# Altium schematic sheet MCU.SchDoc: Hat MCU Group 24
size A3; DrawnBy: Jonny, Jamie, John, David; Address1: ECE Department; Address2: University of Canterbury; Address3: Christchurch 8041; Address4: New Zealand; Revision: 2; SheetNumber: 1; SheetTotal: 2; ImagePath: \\maxwell\elecapp\AltiumDesigner\Templates\uc-logo.png
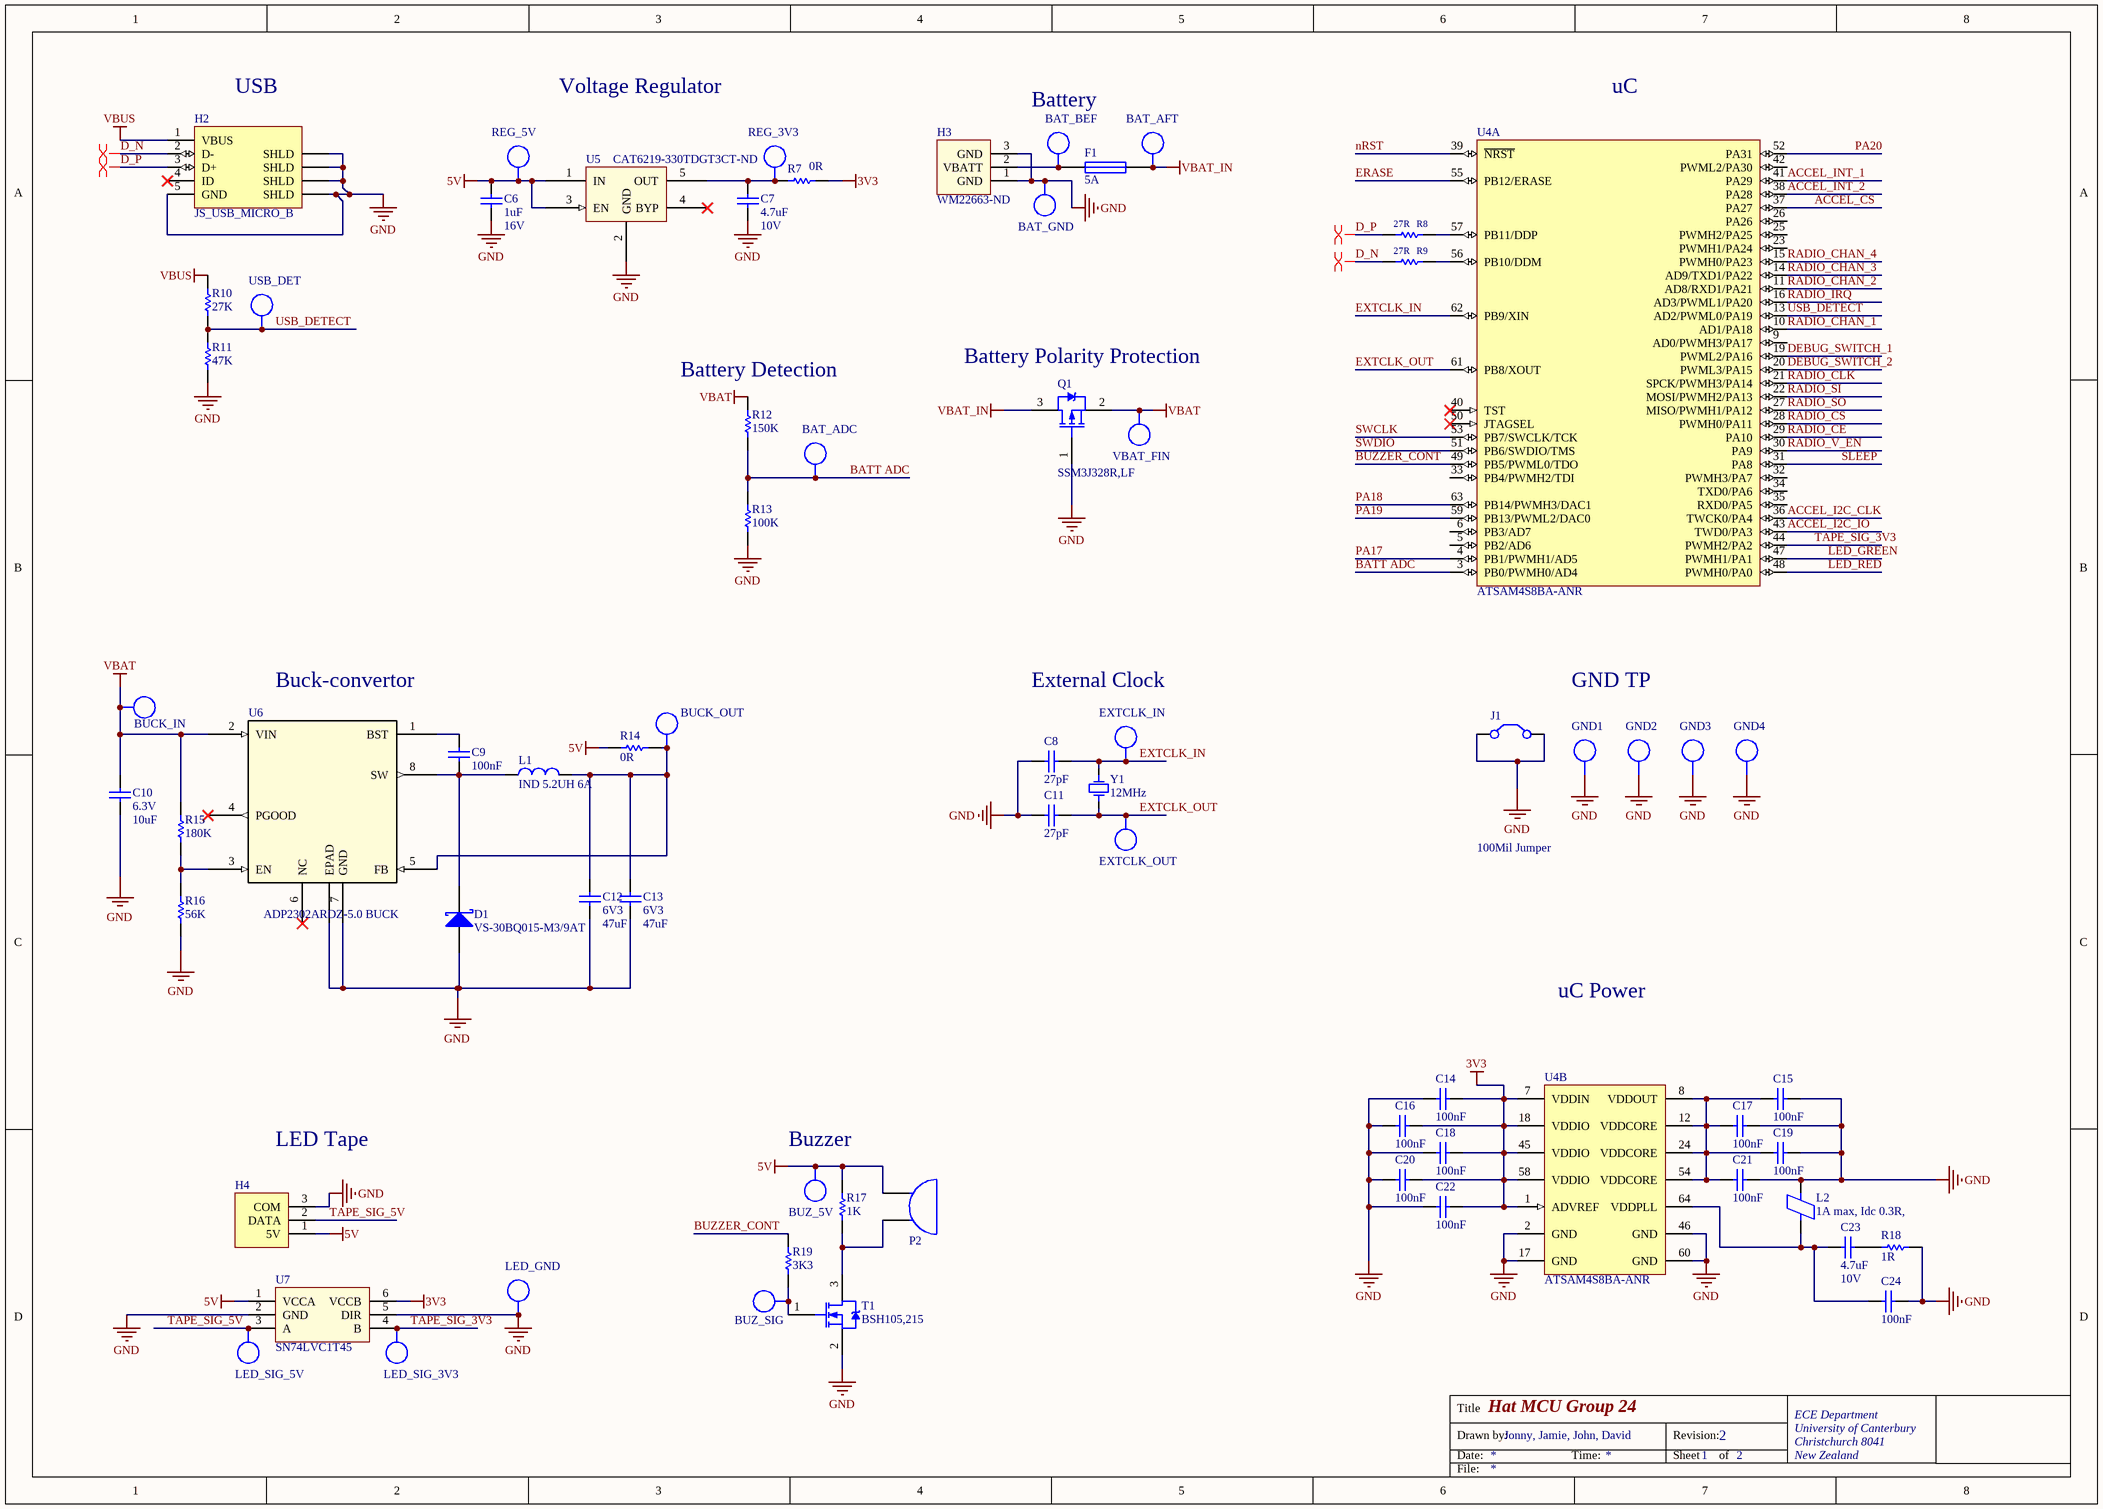
[diagram p0: MCU.SchDoc]

## Parts
BAT_ADC  TP  [TP_1206]  (value not drawn)  (no BOM)
BAT_AFT  TP  [TP_1206]  (value not drawn)  (no BOM)
BAT_BEF  TP  [TP_1206]  (value not drawn)  (no BOM)
BAT_GND  TP  [TP_1206]  (value not drawn)  (no BOM)
BUCK_IN  TP  [TP_1206]  (value not drawn)  (no BOM)
BUCK_OUT  TP  [TP_1206]  (value not drawn)  (no BOM)
BUZ_5V  TP  [TP_1206]  (value not drawn)  (no BOM)
BUZ_SIG  TP  [TP_1206]  (value not drawn)  (no BOM)
C6  Max Voltage: 16V  [CAPC1608L]  (hidden comment: 1uF)
C7  Max Voltage: 10V  [CAPC1608N]  (hidden comment: 4.7uF)
C8  27pF  [CAPC1608L]
C9  100nF  [CAPC1608L]
C10  Voltage - Rated: 6.3V  [CAPC1608L]  (hidden comment: 10uF)
C11  27pF  [CAPC1608L]
C12  Voltage Rating: 6V3  Capacitance: 47uF  [CAPC2012N]  (hidden comment: CC_47uF_0805_6V3)
C13  Voltage Rating: 6V3  Capacitance: 47uF  [CAPC2012N]  (hidden comment: CC_47uF_0805_6V3)
C14  100nF  [CAPC1608L]
C15  100nF  [CAPC1608L]
C16  100nF  [CAPC1608L]
C17  100nF  [CAPC1608L]
C18  100nF  [CAPC1608L]
C19  100nF  [CAPC1608L]
C20  100nF  [CAPC1608L]
C21  100nF  [CAPC1608L]
C22  100nF  [CAPC1608L]
C23  Max Voltage: 10V  [CAPC1608N]  (hidden comment: 4.7uF)
C24  100nF  [CAPC1608L]
D1  VS-30BQ015-M3/9AT  [SMC]
EXTCLK_IN  TP  [TP_1206]  (value not drawn)  (no BOM)
EXTCLK_OUT  TP  [TP_1206]  (value not drawn)  (no BOM)
F1  5A  [RESC3216N]
GND1  TP  [TP_1206]  (value not drawn)  (no BOM)
GND2  TP  [TP_1206]  (value not drawn)  (no BOM)
GND3  TP  [TP_1206]  (value not drawn)  (no BOM)
GND4  TP  [TP_1206]  (value not drawn)  (no BOM)
H2  JS_USB_MICRO_B  [FCI_USB_10118194-0001LF]
H3  Supplier Part Number 1: WM22663-ND  [BATT_HEADER_3POS]  (hidden comment: Battery_HEADER_3pin)
H4  3 Pin Molex KK Hdr  [MOLEX_KK_3_HDR]  (value not drawn)
J1  100Mil Jumper  [JMP2.54]
L1  IND 5.2UH 6A  [INDUCTOR5u2]
L2  1A max, Idc 0.3R,  [INDC3216L]
LED_GND  TP  [TP_1206]  (value not drawn)  (no BOM)
LED_SIG_3V3  TP  [TP_1206]  (value not drawn)  (no BOM)
LED_SIG_5V  TP  [TP_1206]  (value not drawn)  (no BOM)
P2  Piezo Buzzer  [BUZZER]  (value not drawn)
Q1  SSM3J328R,LF  [SOT23_L]
R7  0R  [RESC1608L]
R8  27R  [RESC1608L]
R9  27R  [RESC1608L]
R10  27K  [RESC1608L]
R11  47K  [RESC1608N]
R12  150K  [RESC1608L]
R13  100K  [RESC1608L]
R14  0R  [RESC1608L]
R15  value 180K  [RESC1608L]
R16  56K  [RESC1608L]
R17  1K  [RESC1608L]
R18  1R  [RESC3216L]
R19  3K3  [RESC1608L]
REG_3V3  TP  [TP_1206]  (value not drawn)  (no BOM)
REG_5V  TP  [TP_1206]  (value not drawn)  (no BOM)
T1  BSH105,215  [SOT23_L]
U4  ATSAM4S8BA-ANR  [LQFP64_L]  (parts A,B of 2)
U5  Supplier Part Number: CAT6219-330TDGT3CT-ND  [SOT95P280X145-5N]  (hidden comment: CAT6219-330TDGT3)
U6  ADP2302ARDZ-5.0 BUCK  [RD_8_1]
U7  SN74LVC1T45  [SOT23-6_N]
USB_DET  TP  [TP_1206]  (value not drawn)  (no BOM)
VBAT_FIN  TP  [TP_1206]  (value not drawn)  (no BOM)
Y1  12MHz  [6.0X3.5-4]

## Nets
3V3: C14.2 C16.2 C18.2 C20.2 C22.2 R7.2 U4.1(ADVREF) U4.7(VDDIN) U4.18(VDDIO) U4.45(VDDIO) U4.58(VDDIO) U7.6(VCCB)
5V: BUZ_5V.1 C6.1 H4.1(5V) P2.1 R14.2 R17.2 REG_5V.1 U5.1(IN) U5.3(EN) U7.1(VCCA)
GND: BAT_GND.1 C6.2 C7.1 C8.1 C10.1 C11.1 C12.1 C13.1 C14.1 C15.2 C16.1 C17.2 C18.1 C19.2 C20.1 C21.2 C22.1 C24.1 D1.1(A) GND1.1 GND2.1 GND3.1 GND4.1 H2.5(GND) H2.6(SHLD) H3.1(GND) H3.3(GND) H4.3(COM) J1.1(C1) J1.2(C2) L2.2 LED_GND.1 Q1.1 R11.1 R13.1 R16.1 R18.1 T1.2 U4.2(GND) U4.17(GND) U4.46(GND) U4.60(GND) U5.2(GND) U6.7(GND) U6.EPAD U7.2(GND) U7.5(DIR)
VBAT: BUCK_IN.1 C10.2 Q1.2 R12.2 R15.2 U6.2(VIN) VBAT_FIN.1
VBAT_IN: BAT_AFT.1 F1.2 Q1.3
VBUS: H2.1(VBUS) R10.1
ACCEL_CS: U4.37(PA27)
ACCEL_I2C_CLK: U4.36(TWCK0/PA4)
ACCEL_I2C_IO: U4.43(TWD0/PA3)
ACCEL_INT_1: U4.41(PA29)
ACCEL_INT_2: U4.38(PA28)
BATT ADC: BAT_ADC.1 R12.1 R13.2 U4.3(PB0/PWMH0/AD4)
BUZZER_CONT: R19.1 U4.49(PB5/PWML0/TDO)
D_N: H2.2(D-) R9.1
D_P: H2.3(D+) R8.1
DEBUG_SWITCH_1: U4.19(PWML2/PA16)
DEBUG_SWITCH_2: U4.20(PWML3/PA15)
ERASE: U4.55(PB12/ERASE)
EXTCLK_IN: C8.2 EXTCLK_IN.1 U4.62(PB9/XIN) Y1.3(OSC2)
EXTCLK_OUT: C11.2 EXTCLK_OUT.1 U4.61(PB8/XOUT) Y1.1(OSC1)
LED_GREEN: U4.47(PWMH1/PA1)
LED_RED: U4.48(PWMH0/PA0)
nRST: U4.39(~{NRST})
PA17: U4.4(PB1/PWMH1/AD5)
PA18: U4.63(PB14/PWMH3/DAC1)
PA19: U4.59(PB13/PWML2/DAC0)
PA20: U4.52(PA31)
RADIO_CE: U4.29(PA10)
RADIO_CHAN_1: U4.10(AD1/PA18)
RADIO_CHAN_2: U4.11(AD8/RXD1/PA21)
RADIO_CHAN_3: U4.14(AD9/TXD1/PA22)
RADIO_CHAN_4: U4.15(PWMH0/PA23)
RADIO_CLK: U4.21(SPCK/PWMH3/PA14)
RADIO_CS: U4.28(PWMH0/PA11)
RADIO_IRQ: U4.16(AD3/PWML1/PA20)
RADIO_SI: U4.22(MOSI/PWMH2/PA13)
RADIO_SO: U4.27(MISO/PWMH1/PA12)
RADIO_V_EN: U4.30(PA9)
SLEEP: U4.31(PA8)
SWCLK: U4.53(PB7/SWCLK/TCK)
SWDIO: U4.51(PB6/SWDIO/TMS)
TAPE_SIG_3V3: LED_SIG_3V3.1 U4.44(PWMH2/PA2) U7.4(B)
TAPE_SIG_5V: H4.2(DATA) LED_SIG_5V.1 U7.3(A)
USB_DETECT: R10.2 R11.2 U4.13(AD2/PWML0/PA19) USB_DET.1
NetBAT_BEF_1: BAT_BEF.1 F1.1 H3.2(VBATT)
NetBUCK_OUT_1: BUCK_OUT.1 C12.2 C13.2 L1.2 R14.1 U6.5(FB)
NetBUZ_SIG_1: BUZ_SIG.1 R19.2 T1.1
NetC7_2: C7.2 R7.1 REG_3V3.1 U5.5(OUT)
NetC9_1: C9.1 D1.2(K) L1.1 U6.8(SW)
NetC9_2: C9.2 U6.1(BST)
NetC15_1: C15.1 C17.1 C19.1 C21.1 U4.8(VDDOUT) U4.12(VDDCORE) U4.24(VDDCORE) U4.54(VDDCORE)
NetC23_1: C23.1 R18.2
NetC23_2: C23.2 C24.2 L2.1 U4.64(VDDPLL)
NetP2_2: P2.2 R17.1 T1.3
NetR8_2: R8.2 U4.57(PB11/DDP)
NetR9_2: R9.2 U4.56(PB10/DDM)
NetR15_1: R15.1 R16.2 U6.3(EN)

Not connected (* = marked no-connect by the designer): H2 4(ID)*; U4 5(PB2/AD6) 6(PB3/AD7) 9(AD0/PWMH3/PA17) 23(PWMH1/PA24) 25(PWMH2/PA25) 26(PA26) 32(PWMH3/PA7) 33(PB4/PWMH2/TDI) 34(TXD0/PA6) 35(RXD0/PA5) 40(TST)* 42(PWML2/PA30) 50(JTAGSEL)*; U5 4(BYP)*; U6 4(PGOOD)* 6(NC)*

## Layout directives
differential pair: D_N, D_P

## Notes on the sheet
- (near H2) USB
- Voltage Regulator
- Battery
- uC
- (near R12) Battery Detection
- Battery Polarity Protection
- Buck-convertor
- External Clock
- GND TP
- uC Power
- LED Tape
- Buzzer
- Title
- Drawn by:
- Date:
- Time:
- Revision:
- Sheet
- of
- File:

## Library data of the parts
BAT_ADC BAT_AFT BAT_BEF BAT_GND BUCK_IN BUCK_OUT BUZ_5V BUZ_SIG EXTCLK_IN EXTCLK_OUT GND1-GND4 LED_GND LED_SIG_3V3 LED_SIG_5V REG_3V3 REG_5V USB_DET VBAT_FIN = TP_1206: Test-Point 3.3x1.6x2.1mm SMD; Manufacturer: Harwin Inc; Manufacturer Part Number: S1751-46R; Supplier 1: Digi-Key; Mounting Type: Surface Mount; Type: PC Test Point; Supplier Part Number 1: 952-1478-2-ND; Manufacturer PN: *; Storage Location: ProtoPlace; Supplier 2: Farnell; Supplier Part Number 2: 1826282; Supplier: ECE Dept; Value: TP
C6 = CC_1uF_0603: CAP CER 1uF Y5V -20% +80% 16V 0603; PackageReference: 0603; Code_IPC: 1608 [0603]; Verify: *; Supplier: ECE Dept; Storage Location: PCB Assembly WS; Value: 1uF
C7 C23 = CC_4.7uF_0603: CAP CER 4.7uF X5R +-20%  10V 0603; Note: Footprint corresponds to dimensions for bulk cassette packaging. This case size has tightened tolerances.; PackageReference: 0805; Code_IPC: 2012[0805]; Verify: *; Supplier: ECE Dept; Storage Location: PCB Assembly WS; Value: 4.7uF
C8 C11 = CC_27pF_0603: CAP CER 27pF NPO/COG +-5% 50V 0603; PackageReference: 0603; Code_IPC: 1608 [0603]; Verify: *; Supplier: ECE Dept; Storage Location: PCB Assembly WS; Value: 27pF
C9 C14-C22 C24 = CC_100nF_0603: CAP CER 100nF X7R +-10% 50V 0603; PackageReference: 0603; Code_IPC: 1608 [0603]; Verify: *; Supplier: ECE Dept; Storage Location: PCB Assembly WS; Value: 100nF
C10 = CC_10uF_0603: CAP CER 10UF X5R +-20% 6V3 0603; Supplier: ECE Dept; Storage Location: PCB Assembly WS; Value: 10uF
C12 C13 = CC_47uF_0805_6V3: SAMSUNG ELECTRO-MECHANICS - CL21A476MQCLRNC - CAP, 47UF, 6.3V, MLCC, 0805; Tolerance: 20%; Dielectric: X5R; Supplier 1: Digi-Key; Manufacturer 1: Samsung; Manufacturer Part Number 1: CL21A476MQCLRNC; Stock 1: 94580; Pricing 1: 1=0.56000, 10=0.39100, 50=0.27380, 100=0.23470, 500=0.17602, 1000=0.14865 (USD); RoHS: Yes; Mount: Surface Mount; Case/Package: 0805; Case Code (Metric): 2012; Case Code (Imperial): 0805; Contact Plating: Tin; Min Operating Temperature: -55°C; Max Operating Temperature: 85°C; Packaging: Tape and Reel; Package Quantity: 4000; Termination: Wraparound; Series: CL; Construction: Flat; Length: 2mm; Width: 0.049inch; Thickness: 0.037inch; Depth: 1.25mm; Lead Free: Lead Free; RoHS Compliant: Yes; ComponentLink1URL: https://datasheet.ciiva.com/25723/cl21a476mqclrnc-25723991.pdf?src-supplier=Digi-Key; ComponentLink1Description: https://datasheet.ciiva.com/25723/cl21a476mqclrnc-25723991.pdf?src-supplier=Digi-Key; Supplier Part Number 1: 1276-2420-1-ND
D1 = DS_VS-30BQ015-M3: DIODE, SCHOTTKY, 3A, 15V, DO-214AB / SMC; Manufacturer: Vishay Semiconductors; Forward Voltage: 350mV; Max Forward Surge Current (Ifsm): 650A; Peak Reverse Current: 4mA; Average Rectified Current: 3A; Max Reverse Voltage (DC): 15V; Supplier: Digi-Key; ComponentLink1URL: https://datasheet.ciiva.com/36181/vs-30bq015-m3-9at-36181258.pdf; ComponentLink1Description: https://datasheet.ciiva.com/36181/vs-30bq015-m3-9at-36181258.pdf; Supplier 1: Digi-Key; Supplier 2: Element14; Supplier Part Number 1: VS-30BQ015-M3/9ATGIDKR-ND; Supplier Part Number 2: 2628288; Supplier Part Number: VS-30BQ015-M3/9AT-ND; Manufacturer Part Number: VS-30BQ015-M3/9AT
F1 = FS_Fuse_5.0A: Fuse 5.0A Fast Acting 1206 SMD; Manufacturer Part Number: C1F5; Manufacturer: Bel TRP; Voltage Rating (AC): 125V; Voltage Rating (DC): 63V; DC Cold Resistance: 19mR; Fuse Type: Board Mount (Cartridge Style Excluded); Approvals: CE,cURus; Mount: Surface Mount; Case/Package: 1206; Number of Pins: 2; Case Code (Metric): 3216; Case Code (Imperial): 1206; Contact Plating: Nickel,Tin; Min Operating Temperature: -55°C; Max Operating Temperature: 125°C; Packaging: Tape and Reel; Voltage Rating: 125V; Length: 0.126inch; Width: 0.062inch; Supplier 1: Digi-Key; Stock 1: 725; Pricing 1: 1=0.32, 5=0.312, 10=0.298, 50=0.2662, 100=0.2479, 250=0.22032, 500=0.1836, 1000=0.17442 (USD); ComponentLink1URL: http://www.farnell.com/datasheets/2571625.pdf; ComponentLink1Description: http://www.farnell.com/datasheets/2571625.pdf; ComponentLink2URL: http://belfuse.com/pdfs/C1F.pdf; ComponentLink2Description: http://belfuse.com/pdfs/C1F.pdf; ComponentLink3URL: http://www.mouser.com/ds/2/643/C1F-594910.pdf; ComponentLink3Description: http://www.mouser.com/ds/2/643/C1F-594910.pdf; ComponentLink4URL: https://belfuse.com/resources/StewartConnector/C1F.pdf; ComponentLink4Description: https://belfuse.com/resources/StewartConnector/C1F.pdf; Current Rating: 5A; Supplier Part Number 1: 507-1886-1-ND; Supplier 2: Element14; Supplier Part Number 2: 2848595; Value: 5A
H2 = JS_USB_MICRO_B_SMT: CONN USB MICRO B RECPT SMT R/A; Manufacturer: FCI; Manufacturer Part Number: 10118194-0001LF; Gender: Receptacle; Number of Contacts: 5; Specifications: USB 2.0; Supplier 1: Digi-Key; Supplier Part Number 1: 609-4618-1-ND; Features: Shielded, Solder Retention; Mounting Type: Surface Mount, Right Angle, Horizontal
H3 = Battery_HEADER_3pin: 3Pin Header 2.54mm spacing / Digikey #WM22663-ND; Supplier 1: Digi-Key
H4 = LED_Strip_Header: CONN HEADER 3POS 2.54mm VERT_Thru Hole; Manufacturer: Molex; Manufacturer PN: 22-23-2031; Supplier Part Number 1: 9731156; Supplier: ECE Dept; Supplier 1: Farnell; Storage Location: ECE Dept Store; Value: 3 Pin Molex KK Hdr
J1 = TP_JUMPER: 2.54mm Jumper Thru Hole; Pitch Spacing: 2.54; No. of Rows: 1; No. of Positions: 2; Supplier: ECE Dept; Supplier 1: Farnell; Supplier Part Number 1: 1097975; Storage Location: ECE$ Store
L1 = CDRH104RNP-5R2NC: FIXED IND 5.2UH 6A 22 MOHM SMD; Manufacturer: Sumida America Components Inc.; Material - Core: Ferrite; Tolerance: ±30%; Current - Saturation: 5.6A; Shielding: Shielded; DC Resistance (DCR): 22 mOhm Max; Supplier 1: Digi-Key; Manufacturer Part Number: CDRH104RNP-5R2NC; RoHS: RoHS Compliant; Category: Inductors, Coils, Chokes; Stock 1: 3849; Pricing 1: 1=2.9, 10=2.678, 100=1.8743, 500=1.5173 (NZD); Packaging: Cut Tape (CT); Part Status: Active; Type: -; Q @ Freq: -; Frequency - Self Resonant: -; Ratings: -; Operating Temperature: -40°C ~ 100°C; Mounting Type: Surface Mount; Package / Case: Nonstandard; Supplier Device Package: -; Size / Dimension: 0.402" L x 0.394" W (10.20mm x 10.00mm); Height - Seated (Max): 0.157" (4.00mm); ComponentLink1URL: http://products.sumida.com/products/pdf/CDRH104R.pdf; ComponentLink1Description: http://products.sumida.com/products/pdf/CDRH104R.pdf; Supplier Part Number 1: 308-2280-1-ND
L2 = IN_Ferrite-Bead: Ferrite Bead, Rdc 0.3R, Z100MHZ 600R, Imax 1A, SMD 1206; Manufacturer: FAIR-RITE; Manufacturer PN: 2512066017Y1; DC Current Rating: 1; DC Resistance Max: 0.08; Ferrite Case Style: 1206 ^3216 Metric]; Frequency Range: 50MHz to 1; Impedance: 600; Impedance Tolerance: ± 25%; Supplier: ECE Dept; Storage Location: PCB Assembly WS; Ferrite Mounting: SMD; Supplier 1: Farnell; Supplier Part Number 1: 1612060; Manufacturer Part Number: 2512066017Y1; Value: 1A max, Idc 0.3R,
P2 = Piezo Buzzer: TDK - PS1240P02BT - BUZZER, PIEZO, 70DB, 12.2MM; Number of Terminals/Pins: 2; Frequency: 4kHz; Operating Supply Voltage: 3V; Washable: No; Supplier 1: Digi-Key; Manufacturer 1: TDK; Manufacturer Part Number 1: PS1240P02BT; Stock 1: 24025; Pricing 1: 1=0.61000, 10=0.52500, 25=0.49120, 50=0.46580, 100=0.44110 (USD); RoHS: Yes; Mount: Through Hole; Number of Pins: 2; Min Operating Temperature: -10°C; Max Operating Temperature: 70°C; Package Quantity: 1; Packaging: Tape and Reel; Termination: PC Pins; Voltage Rating (DC): 3V; Series: PS; Diameter: 12.2mm; Height: 6.5mm; Lead Free: Lead Free; RoHS Compliant: Yes; ComponentLink1URL: https://datasheet.ciiva.com/0/ef532-ps-112.pdf?src-supplier=Digi-Key; ComponentLink1Description: https://datasheet.ciiva.com/0/ef532-ps-112.pdf?src-supplier=Digi-Key; ComponentLink2URL: https://datasheet.ciiva.com/0/ef532-ps-111.pdf?src-supplier=Digi-Key; ComponentLink2Description: https://datasheet.ciiva.com/0/ef532-ps-111.pdf?src-supplier=Digi-Key; ComponentLink3URL: https://datasheet.ciiva.com/3306/ef532-ps-3306958.pdf?src-supplier=Avnet; ComponentLink3Description: https://datasheet.ciiva.com/3306/ef532-ps-3306958.pdf?src-supplier=Avnet; ComponentLink4URL: https://datasheet.ciiva.com/16225/ef532-ps-16225062.pdf?src-supplier=Onlinecomponents.com; ComponentLink4Description: https://datasheet.ciiva.com/16225/ef532-ps-16225062.pdf?src-supplier=Onlinecomponents.com; Supplier Part Number 1: 445-2525-1-ND
Q1 = TM_SSM3J328R: MOSFET P-CH 20V 6A SOT23-3; Manufacturer: Toshiba; FET Feature: Logic Level Gate, 1.5V Drive; FET Type: MOSFET P-Channel, Metal Oxide; Gate Charge (Qg) @ Vgs: 12.8nC @ 4.5V; Input Capacitance (Ciss) @ Vds: 840pF @ 10V; Power - Max: 1W; Rds On Max: 29.8mR; Drain to Source Resistance: 47.4mR; Turn-On Delay Time: 32ns; Power Dissipation: 2W; Number of Channels: 1; Turn-Off Delay Time: 107ns; Gate to Source Voltage (Vgs): 8V; Input Capacitance: 840pF; Element Configuration: Single; Drain to Source Breakdown Voltage: -20V; Vgs(th) (Max) @ Id: 1V @ 1mA; Current - Continuous Drain (Id) @ 25° C: 6A; Drain to Source Voltage (Vdss): 20V; Package / Case: SOT-23-3 Flat Leads; Supplier Device Package: SOT-23F; Pricing: 1=0.79, 10=0.658, 25=0.5772, 100=0.4939, 250=0.42836, 500=0.36284, 1000=0.27972 (NZD); Storage Location: PCB Assembly WS; Supplier: Digi-Key; ComponentLink1URL: https://datasheet.ciiva.com/11158/ssm3j328r-datasheet-en-20140301-11158652.pdf; ComponentLink1Description: https://datasheet.ciiva.com/11158/ssm3j328r-datasheet-en-20140301-11158652.pdf; Supplier Part Number: SSM3J328RLFDKR-ND; Max Operating Temperature: 150°C; Mount: Surface Mount; Packaging: Tape and Reel; Min Operating Temperature: -55°C; Continuous Drain Current (ID): 6A; Radiation Hardening: No; Max Power Dissipation: 1W; Package Quantity: 3000; Case/Package: SOT-23-3; Number of Pins: 3; Number of Elements: 1; Supplier 1: Digi-Key; Supplier Part Number 1: SSM3J328RLFDKR-ND; Manufacturer Part Number: SSM3J328R,LF
R7 R14 = RS_0R0: RES 0.0 OHM 1/10W 5% 0603 SMD; Storage Location: PCB Assembly WS; Supplier: ECE Dept; Value: 0R
R8 R9 = RS_27R: RES 27 OHM 1/10W 5% 0603 SMD; Storage Location: PCB Assembly WS; Supplier: ECE Dept; Value: 27R
R10 = RS_27K: RES 27K OHM 1/10W 5% 0603 SMD; Storage Location: PCB Assembly WS; Supplier: ECE Dept; Value: 27K
R11 = RS_47K: RES 47.0K OHM 1/10W 5% 0603 SMD; Storage Location: PCB Assembly WS; Supplier: ECE Dept; Value: 47K
R12 = RS_150K: RES 150K OHM 1/10W 5% 0603 SMD; Storage Location: PCB Assembly WS; Supplier: ECE Dept; Value: 150K
R13 = RS_100K: RES 100K OHM 1/10W 5% 0603 SMD; Storage Location: PCB Assembly WS; Supplier: ECE Dept; Value: 100K
R15 = RS_180K: RES 180K OHM 1/10W 5% 0603 SMD; Storage Location: PCB Assembly WS; Supplier: ECE Dept
R16 = RS_56K: RES 56.0K OHM 1/10W 5% 0603 SMD; Storage Location: PCB Assembly WS; Supplier: ECE Dept; Value: 56K
R17 = RS_1K: RES 1.0K OHM 1/10W 5% 0603 SMD; Storage Location: PCB Assembly WS; Supplier: ECE Dept; Value: 1K
R18 = RT_1R: RES 1R OHM 1/4W 5% 1206 SMD; Storage Location: PCB Assembly WS; Supplier: ECE Dept; Value: 1R
R19 = RS_3K3: RES 3.3K OHM 1/10W 5% 0603 SMD; Storage Location: PCB Assembly WS; Supplier: ECE Dept; Value: 3K3
T1 = TM_BSH105: MOSFET N-CH 20V 1.05A SOT-23; Manufacturer: NXP Semiconductors; FET Type: MOSFET N-Channel, Metal Oxide; Gate Charge (Qg) @ Vgs: 3.9nC @ 4.5V; Input Capacitance (Ciss) @ Vds: 152pF @ 16V; Power - Max: 417mW; Rds On (Max) @ Id, Vgs: 200 mOhm @ 600mA, 4.5V; Supplier 1: Farnell; Supplier 2: Digi-Key; Current - Continuous Drain (Id) @ 25° C: 1.05A; Drain to Source Voltage (Vdss): 20V; Package / Case: TO-236-3, SC-59, SOT-23-3; Pricing: 1=0.53, 10=0.42, 25=0.3544, 100=0.2885, 250=0.23896, 500=0.1974, 1000=0.14785 (NZD); Supplier Part Number 1: 1758066; Supplier Part Number 2: 568-6215-1-ND; Storage Location: PCB Assembly WS; Supplier: ECE Dept; Manufacturer Part Number: BSH105,215
U4 = SE_ATSAM4S16BA-MU: IC MCU 32BIT 512KB FLASH 64LQFP; Manufacturer: Atmel; Connectivity: I²C, IrDA, Memory Card, SPI, SSC, UART/USART, USB; Core Processor: ARM® Cortex®-M4; Core Size: 32-Bit; Data Converters: A/D 11x12b, D/A 2x12b; Number of I/O: 47; Peripherals: Brown-out Detect/Reset, DMA, POR, PWM, WDT; Program Memory Size: 512KB (512K x 8); RAM Size: 128K x 8; Speed: 120MHz; Voltage - Supply (Vcc/Vdd): 1.62 V ~ 3.6 V; PackageVersion: revJ, Jul-2007; PackageReference: 64PS; PackageDescription: 64-Pin Quad Flat No-Lead (QFN) Sawn, 9 x 9 x 1.0 mm Body, 0.5 mm Pitch, Exposed Pad; Code_JEDEC: MO-220VMMD-3; ComponentLink1Description: Manufacturer URL; ComponentLink1URL: http://www.atmel.com/; ComponentLink2Description: SAM4S Series Datasheet; ComponentLink2URL: http://www.atmel.com/dyn/resources/prod_documents/11100.pdf; ComponentLink3Description: SAM4S Series Summary; ComponentLink3URL: http://www.atmel.com/dyn/resources/prod_documents/11100S.pdf; Supplier 1: Digi-Key; Package / Case: 64-LQFP; Packaging: Cut Tape (CT); Program Memory Type: FLASH; Supplier Part Number 1: ATSAM4S8BA-ANRCT-ND; Manufacturer Part Number: ATSAM4S8BA-ANR
U5 = SV_CAT6219-330TDGT3: IC REG LIN 3.3V 500MA TSOT23-5; Voltage - Input (Max): 5.5V; Voltage Dropout (Max): 0.5V @ 500mA; Manufacturer Part Number: CAT6219-330TDGT3; Base Part Number: CAT6219; Current - Output: 500mA; Package / Case: SOT-23-5 Thin, TSOT-23-5; Supplier: Digi-Key; Supplier Device Package: TSOT-23-5; Voltage - Output (Min/Fixed): 3.3V; ComponentLink1URL: http://www.onsemi.com/pub/Collateral/CAT6219-D.PDF; ComponentLink1Description: http://www.onsemi.com/pub/Collateral/CAT6219-D.PDF; Supplier 1: Digi-Key; ComponentLink2Description: CAT6219 Datasheet; ComponentLink2URL: \\maxwell\elecapp\AltiumDesigner\Libraries\DatasheetsNew\ENCE461\CAT6219-D.PDF
U6 = ADP2302ARDZ-5.0-R7: IC REG BUCK 5V 2A 8SOIC; Vendor: Analog Devices Inc; Frequency - Switching: 700kHz; Output Type: Fixed; Voltage - Input (Max): 20V; Manufacturer_Part_Number: ADP2302ARDZ-5.0-R7; Type: DEV; Value: Value; Supplier 1: Digi-Key; Current - Output: 2A; Voltage - Output (Min/Fixed): 5V; Supplier Part Number 1: ADP2302ARDZ-5.0-R7CT-ND; ComponentLink1Description: ADP2302ARDZ-5.0 Datasheet; ComponentLink1URL: \\maxwell\elecapp\AltiumDesigner\Libraries\DatasheetsNew\ENCE461\ADP2302_2303.pdf
U7 = SN74LVC1T45: 1.8V - 5V level converter
Y1 = XT_CRYSTAL_12MHz_18pF: CRYSTAL 12MHZ 18PF 6X3.5mm SMD; Manufacturer: CTS-Frequency Controls; Manufacturer Part Number: 406C35D12M00000; ESR (Equivalent Series Resistance): 60 Ohm; Frequency Stability: ±50ppm; Frequency Tolerance: ±30ppm; Operating Mode: Fundamental; Supplier 1: Digi-Key; Height: 0.047" (1.20mm); Load Capacitance: 18pF; Mounting Type: Surface Mount; Operating Temperature: -20°C ~ 70°C; Package / Case: 4-SMD, No Lead (DFN, LCC); Size / Dimension: 0.236" L x 0.138" W (6.00mm x 3.50mm); Supplier Part Number 1: CTX855CT-ND; Frequency: 12MHz